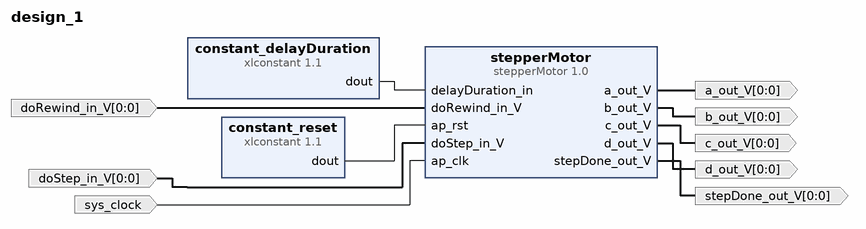
[diagram p0: block diagram of the top level]
# Vivado block design design_1, Vivado 2014.4
create_bd_design design_1

create_bd_port -dir I -type clk sys_clock
set_property -dict {CONFIG.FREQ_HZ 100000000 CONFIG.PHASE 0.000} [get_bd_ports sys_clock]
create_bd_port -dir I -from 0 -to 0 -type data doStep_in_V
set_property -dict [list \
  CONFIG.LAYERED_METADATA {xilinx.com:interface:datatypes:1.0 {DATA {datatype {name {attribs {resolve_type immediate dependency {} format string minimum {} maximum {}} value {}} bitwidth {attribs {resolve_type immediate dependency {} format long minimum {} maximum {}} value 1} bitoffset {attribs {resolve_type immediate dependency {} format long minimum {} maximum {}} value 0} integer {signed {attribs {resolve_type immediate dependency {} format bool minimum {} maximum {}} value false}}}}}} \
] [get_bd_ports doStep_in_V]
create_bd_port -dir O -from 0 -to 0 -type data a_out_V
create_bd_port -dir O -from 0 -to 0 -type data b_out_V
create_bd_port -dir O -from 0 -to 0 -type data c_out_V
create_bd_port -dir O -from 0 -to 0 -type data d_out_V
create_bd_port -dir I -from 0 -to 0 -type data doRewind_in_V
set_property -dict [list \
  CONFIG.LAYERED_METADATA {xilinx.com:interface:datatypes:1.0 {DATA {datatype {name {attribs {resolve_type immediate dependency {} format string minimum {} maximum {}} value {}} bitwidth {attribs {resolve_type immediate dependency {} format long minimum {} maximum {}} value 1} bitoffset {attribs {resolve_type immediate dependency {} format long minimum {} maximum {}} value 0} integer {signed {attribs {resolve_type immediate dependency {} format bool minimum {} maximum {}} value false}}}}}} \
] [get_bd_ports doRewind_in_V]
create_bd_port -dir O -from 0 -to 0 -type data stepDone_out_V

create_bd_cell -type ip -vlnv xilinx.com:ip:xlconstant:1.1 constant_reset
set_property -dict {CONFIG.CONST_WIDTH 1 CONFIG.CONST_VAL 0} [get_bd_cells constant_reset]
create_bd_cell -type ip -vlnv xilinx.com:ip:xlconstant:1.1 constant_delayDuration
set_property -dict {CONFIG.CONST_WIDTH 32 CONFIG.CONST_VAL 100000000} [get_bd_cells constant_delayDuration]
create_bd_cell -type ip -vlnv xilinx.com:hls:stepperMotor:1.0 stepperMotor

# ---- connections ----

connect_bd_net -net stepperMotor_0_a_out_V [get_bd_pins stepperMotor/a_out_V] [get_bd_ports a_out_V]
connect_bd_net -net stepperMotor_0_b_out_V [get_bd_pins stepperMotor/b_out_V] [get_bd_ports b_out_V]
connect_bd_net -net stepperMotor_0_c_out_V [get_bd_pins stepperMotor/c_out_V] [get_bd_ports c_out_V]
connect_bd_net -net stepperMotor_0_d_out_V [get_bd_pins stepperMotor/d_out_V] [get_bd_ports d_out_V]
connect_bd_net -net stepperMotor_0_stepDone_out_V [get_bd_pins stepperMotor/stepDone_out_V] [get_bd_ports stepDone_out_V]
connect_bd_net -net xlconstant_0_dout [get_bd_pins constant_delayDuration/dout] [get_bd_pins stepperMotor/delayDuration_in]
connect_bd_net [get_bd_ports doRewind_in_V] [get_bd_pins stepperMotor/doRewind_in_V]
connect_bd_net [get_bd_ports doStep_in_V] [get_bd_pins stepperMotor/doStep_in_V]
connect_bd_net [get_bd_pins constant_reset/dout] [get_bd_pins stepperMotor/ap_rst]
connect_bd_net [get_bd_ports sys_clock] [get_bd_pins stepperMotor/ap_clk]

validate_bd_design
save_bd_design
